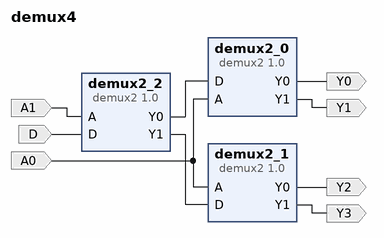
[diagram p0: block diagram of the top level]
# Vivado block design demux4, xc7z020clg484-2, Vivado 2024.1
create_bd_design demux4

create_bd_port -dir I A0
create_bd_port -dir O Y0
create_bd_port -dir O Y1
create_bd_port -dir I A1
create_bd_port -dir I D
create_bd_port -dir O Y2
create_bd_port -dir O Y3

create_bd_cell -type ip -vlnv xilinx.com:user:demux2:1.0 demux2_0
create_bd_cell -type ip -vlnv xilinx.com:user:demux2:1.0 demux2_1
create_bd_cell -type ip -vlnv xilinx.com:user:demux2:1.0 demux2_2

# ---- connections ----

connect_bd_net -net A_0_1 [get_bd_ports A0] [get_bd_pins demux2_0/A] [get_bd_pins demux2_1/A]
connect_bd_net -net A_1_1 [get_bd_ports A1] [get_bd_pins demux2_2/A]
connect_bd_net -net D_0_1 [get_bd_ports D] [get_bd_pins demux2_2/D]
connect_bd_net [get_bd_pins demux2_0/Y0] [get_bd_ports Y0]
connect_bd_net [get_bd_pins demux2_0/Y1] [get_bd_ports Y1]
connect_bd_net [get_bd_pins demux2_1/Y0] [get_bd_ports Y2]
connect_bd_net [get_bd_pins demux2_1/Y1] [get_bd_ports Y3]
connect_bd_net [get_bd_pins demux2_2/Y0] [get_bd_pins demux2_0/D]
connect_bd_net [get_bd_pins demux2_2/Y1] [get_bd_pins demux2_1/D]

validate_bd_design
save_bd_design
